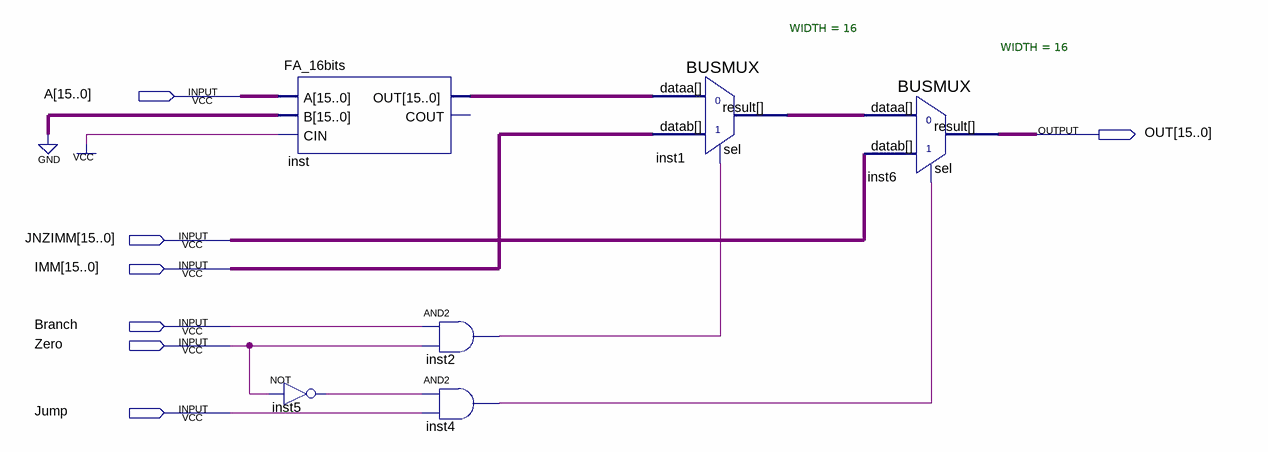
[diagram p0: schematic sheet]
// Quartus schematic CK.bdf as structural Verilog: 6 symbols, 7 pins
module CK (
  input  [15:0] A,
  input  [15:0] JNZIMM,
  input  [15:0] IMM,
  input  Branch,
  input  Zero,
  input  Jump,
  output [15:0] OUT
);

  wire inst2_out, inst4_out, inst5_out;
  wire [15:0] inst1_result, inst_out;

  FA_16bits inst (.A(A), .B({16{1'b0}}), .CIN(1'b1), .OUT(inst_out));  // open: COUT
  not inst5 (inst5_out, Zero);
  and inst2 (inst2_out, Branch, Zero);
  and inst4 (inst4_out, inst5_out, Jump);
  BUSMUX #(.WIDTH(16)) inst1 (.datab(IMM), .sel(inst2_out), .dataa(inst_out), .result(inst1_result));
  BUSMUX #(.WIDTH(16)) inst6 (.datab(JNZIMM), .sel(inst4_out), .dataa(inst1_result), .result(OUT));
endmodule
